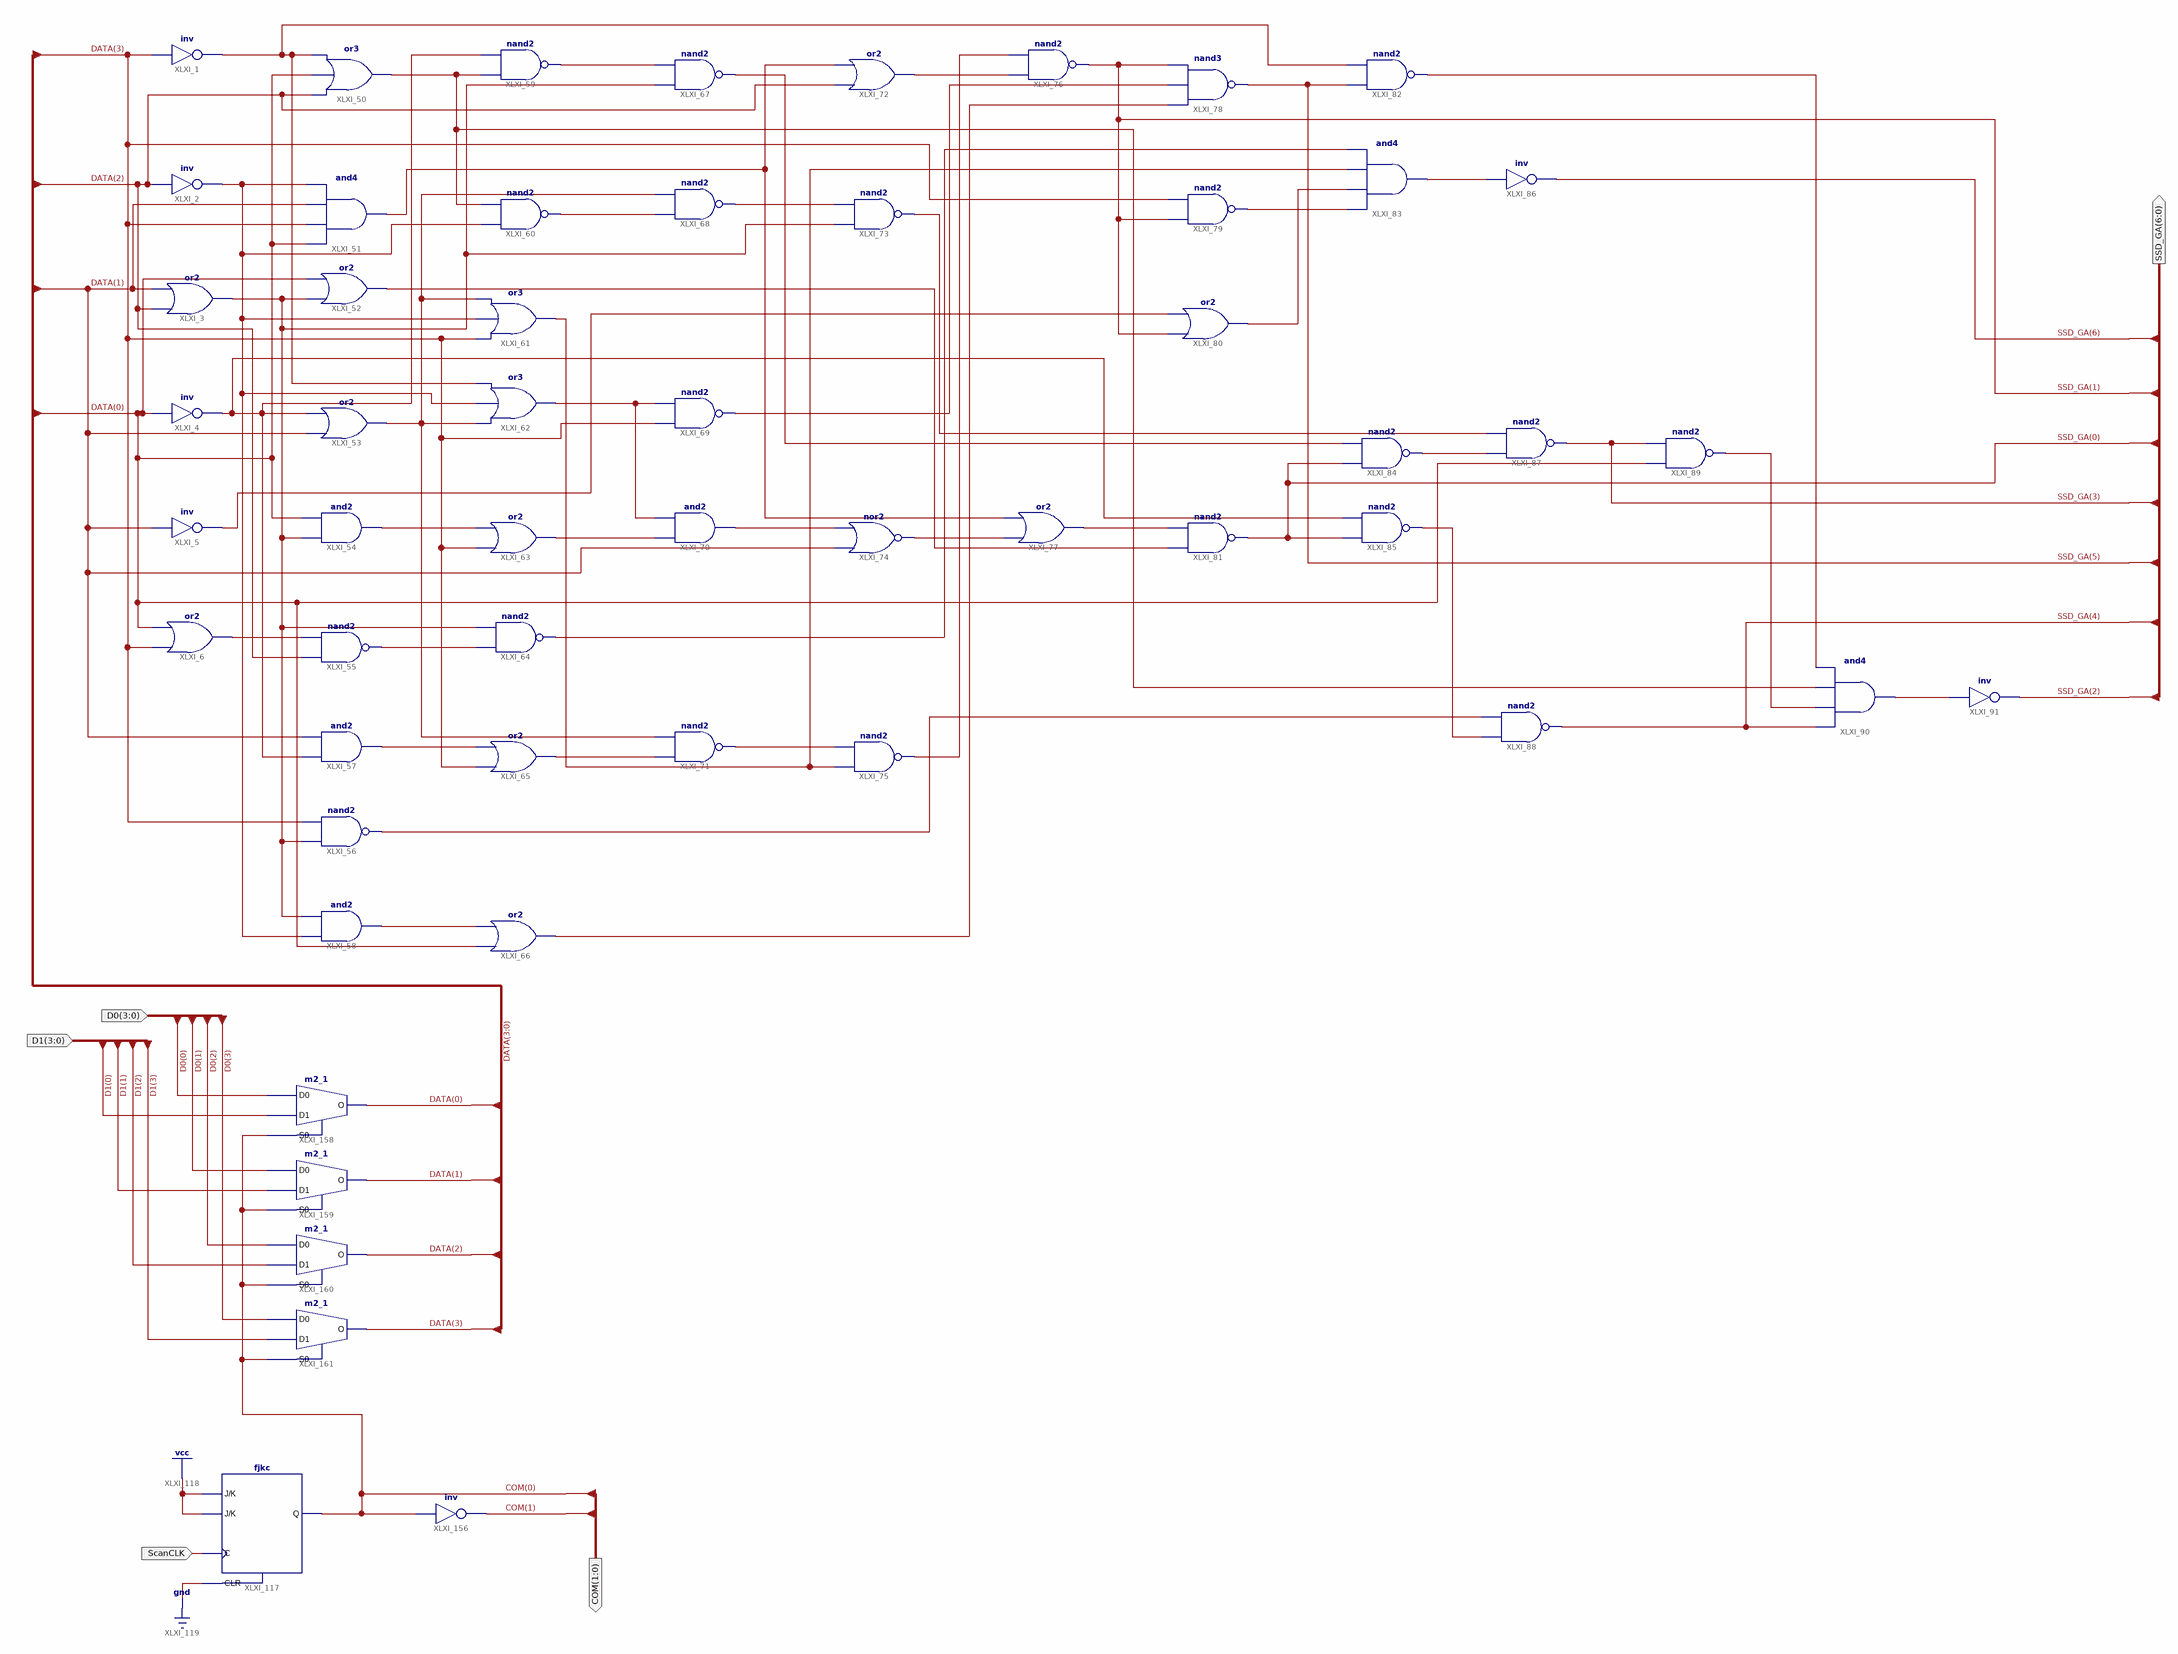
[diagram p0: schematic sheet 1]
// Xilinx ISE schematic ssd2d0fb.sch (spartan6) as structural Verilog: 54 symbols, 5 ports
module ssd2d0fb (
  input  [3:0] D1,
  input  [3:0] D0,
  input  ScanCLK,
  output [6:0] SSD_GA,
  output [1:0] COM
);

  wire XLXN_8, XLXN_9, XLXN_10, XLXN_11, XLXN_12, XLXN_13, XLXN_14, XLXN_15, XLXN_16, XLXN_17, XLXN_18,
       XLXN_20, XLXN_21, XLXN_22, XLXN_23, XLXN_25, XLXN_26, XLXN_29, XLXN_30, XLXN_31, XLXN_32, XLXN_33,
       XLXN_34, XLXN_65, XLXN_67, XLXN_68, XLXN_71, XLXN_72, XLXN_74, XLXN_75, XLXN_77, XLXN_78, XLXN_79,
       XLXN_82, XLXN_83, XLXN_84, XLXN_85, XLXN_86, XLXN_88, XLXN_90, XLXN_91;
  wire [3:0] DATA;

  not XLXI_1 (XLXN_12, DATA[3]);
  not XLXI_2 (XLXN_10, DATA[2]);
  or XLXI_3 (XLXN_29, DATA[2], DATA[1]);
  not XLXI_4 (XLXN_9, DATA[0]);
  not XLXI_5 (XLXN_71, DATA[1]);
  or XLXI_6 (XLXN_8, DATA[3], DATA[0]);
  and XLXI_51 (XLXN_25, DATA[0], DATA[3], DATA[1], XLXN_10);
  or XLXI_52 (XLXN_72, XLXN_29, DATA[0]);
  or XLXI_53 (XLXN_20, DATA[1], XLXN_9);
  and XLXI_54 (XLXN_13, XLXN_29, DATA[0]);
  nand XLXI_55 (XLXN_14, DATA[2], XLXN_8);
  and XLXI_57 (XLXN_15, XLXN_9, DATA[1]);
  nand XLXI_56 (XLXN_85, XLXN_29, DATA[3]);
  and XLXI_58 (XLXN_16, XLXN_10, XLXN_29);
  or XLXI_50 (XLXN_11, DATA[2], DATA[0], XLXN_12);
  nand XLXI_59 (XLXN_17, XLXN_11, XLXN_9);
  nand XLXI_60 (XLXN_18, XLXN_10, XLXN_11);
  or XLXI_61 (XLXN_77, DATA[3], XLXN_10, XLXN_20);
  or XLXI_62 (XLXN_22, XLXN_20, XLXN_10, XLXN_12);
  or XLXI_63 (XLXN_21, DATA[3], XLXN_13);
  nand XLXI_64 (XLXN_78, XLXN_14, XLXN_29);
  or XLXI_65 (XLXN_23, DATA[3], XLXN_15);
  or XLXI_66 (XLXN_68, DATA[0], XLXN_16);
  nand XLXI_67 (XLXN_79, XLXN_29, XLXN_17);
  nand XLXI_68 (XLXN_26, XLXN_18, XLXN_20);
  nand XLXI_69 (XLXN_67, DATA[3], XLXN_22);
  and XLXI_70 (XLXN_30, XLXN_21, XLXN_22);
  nand XLXI_71 (XLXN_31, XLXN_23, XLXN_20);
  or XLXI_72 (XLXN_33, DATA[2], XLXN_25);
  nand XLXI_73 (XLXN_84, XLXN_29, XLXN_26);
  nor XLXI_74 (XLXN_32, DATA[1], XLXN_30);
  nand XLXI_75 (XLXN_34, XLXN_77, XLXN_31);
  nand XLXI_76 (SSD_GA[1], XLXN_33, XLXN_34);
  or XLXI_77 (XLXN_65, XLXN_32, XLXN_25);
  nand XLXI_78 (SSD_GA[5], XLXN_68, XLXN_67, SSD_GA[1]);
  nand XLXI_79 (XLXN_74, SSD_GA[1], DATA[3]);
  or XLXI_80 (XLXN_75, SSD_GA[1], XLXN_71);
  nand XLXI_81 (SSD_GA[0], XLXN_72, XLXN_65);
  nand XLXI_82 (XLXN_90, SSD_GA[5], XLXN_12);
  and XLXI_83 (XLXN_82, XLXN_74, XLXN_75, XLXN_77, XLXN_78);
  nand XLXI_84 (XLXN_83, SSD_GA[0], XLXN_79);
  nand XLXI_85 (XLXN_86, SSD_GA[0], XLXN_9);
  nand XLXI_87 (SSD_GA[3], XLXN_83, XLXN_84);
  not XLXI_86 (SSD_GA[6], XLXN_82);
  nand XLXI_88 (SSD_GA[4], XLXN_86, XLXN_85);
  nand XLXI_89 (XLXN_88, DATA[0], SSD_GA[3]);
  and XLXI_90 (XLXN_91, SSD_GA[4], XLXN_88, XLXN_11, XLXN_90);
  not XLXI_91 (SSD_GA[2], XLXN_91);
  m2_1 XLXI_158 (.D0(D0[0]), .D1(D1[0]), .S0(COM[0]), .O(DATA[0]));
  m2_1 XLXI_159 (.D0(D0[1]), .D1(D1[1]), .S0(COM[0]), .O(DATA[1]));
  m2_1 XLXI_160 (.D0(D0[2]), .D1(D1[2]), .S0(COM[0]), .O(DATA[2]));
  m2_1 XLXI_161 (.D0(D0[3]), .D1(D1[3]), .S0(COM[0]), .O(DATA[3]));
  not XLXI_156 (COM[1], COM[0]);
  fjkc XLXI_117 (.C(ScanCLK), .CLR(1'b0), .J(1'b1), .K(1'b1), .Q(COM[0]));
endmodule
